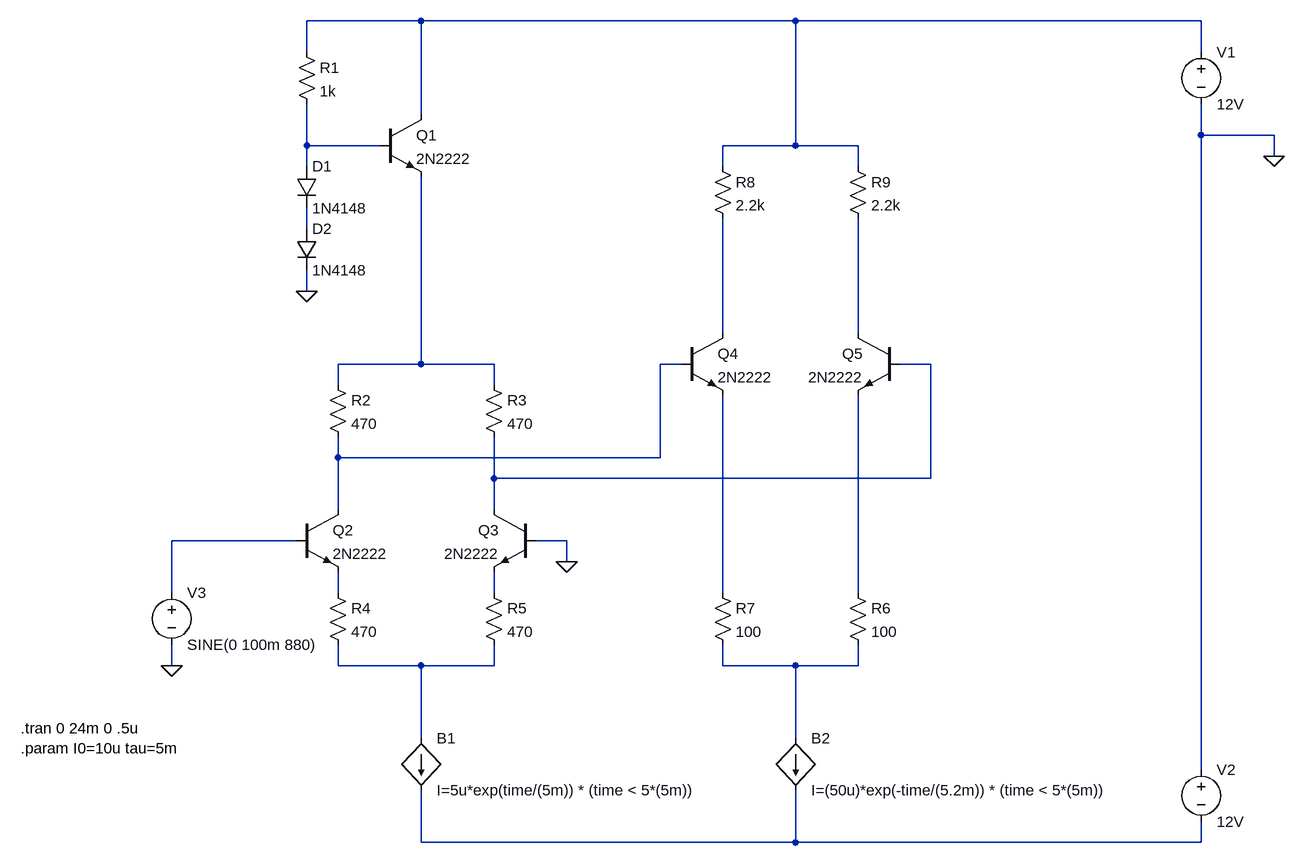
[diagram p0: schematic rabotnik_v1.asc]
rabotnik_v1.asc, the LTspice schematic file:
Version 4
SHEET 1 1540 1352
WIRE 208 80 32 80
WIRE 784 80 208 80
WIRE 1408 80 784 80
WIRE 32 128 32 80
WIRE 1408 128 1408 80
WIRE 208 224 208 80
WIRE 1408 256 1408 208
WIRE 1520 256 1408 256
WIRE 32 272 32 208
WIRE 144 272 32 272
WIRE 784 272 784 80
WIRE 784 272 672 272
WIRE 880 272 784 272
WIRE 1520 288 1520 256
WIRE 32 304 32 272
WIRE 672 304 672 272
WIRE 880 304 880 272
WIRE 32 400 32 368
WIRE 32 496 32 464
WIRE 672 560 672 384
WIRE 880 560 880 384
WIRE 208 608 208 320
WIRE 208 608 80 608
WIRE 320 608 208 608
WIRE 608 608 576 608
WIRE 992 608 944 608
WIRE 80 640 80 608
WIRE 320 640 320 608
WIRE 80 752 80 720
WIRE 576 752 576 608
WIRE 576 752 80 752
WIRE 320 784 320 720
WIRE 992 784 992 608
WIRE 992 784 320 784
WIRE 80 832 80 752
WIRE 320 832 320 784
WIRE 16 880 -176 880
WIRE 432 880 384 880
WIRE 432 912 432 880
WIRE -176 960 -176 880
WIRE 80 960 80 928
WIRE 320 960 320 928
WIRE 672 960 672 656
WIRE 880 960 880 656
WIRE -176 1072 -176 1040
WIRE 80 1072 80 1040
WIRE 208 1072 80 1072
WIRE 320 1072 320 1040
WIRE 320 1072 208 1072
WIRE 672 1072 672 1040
WIRE 784 1072 672 1072
WIRE 880 1072 880 1040
WIRE 880 1072 784 1072
WIRE 208 1184 208 1072
WIRE 784 1184 784 1072
WIRE 1408 1232 1408 256
WIRE 208 1344 208 1264
WIRE 784 1344 784 1264
WIRE 784 1344 208 1344
WIRE 1408 1344 1408 1312
WIRE 1408 1344 784 1344
FLAG 32 496 0
FLAG 1520 288 0
FLAG 432 912 0
FLAG -176 1072 0
SYMBOL npn2 144 224 R0
SYMATTR InstName Q1
SYMATTR Value 2N2222
SYMBOL voltage 1408 112 R0
WINDOW 123 0 0 Left 0
WINDOW 39 0 0 Left 0
SYMATTR InstName V1
SYMATTR Value 12V
SYMBOL voltage 1408 1216 R0
WINDOW 123 0 0 Left 0
WINDOW 39 0 0 Left 0
SYMATTR InstName V2
SYMATTR Value 12V
SYMBOL res 16 112 R0
SYMATTR InstName R1
SYMATTR Value 1k
SYMBOL diode 16 304 R0
SYMATTR InstName D1
SYMATTR Value 1N4148
SYMBOL diode 16 400 R0
SYMATTR InstName D2
SYMATTR Value 1N4148
SYMBOL res 304 624 R0
SYMATTR InstName R3
SYMATTR Value 470
SYMBOL res 64 624 R0
SYMATTR InstName R2
SYMATTR Value 470
SYMBOL npn2 16 832 R0
SYMATTR InstName Q2
SYMATTR Value 2N2222
SYMBOL npn2 384 832 M0
SYMATTR InstName Q3
SYMATTR Value 2N2222
SYMBOL res 64 944 R0
SYMATTR InstName R4
SYMATTR Value 470
SYMBOL res 304 944 R0
SYMATTR InstName R5
SYMATTR Value 470
SYMBOL voltage -176 944 R0
WINDOW 123 0 0 Left 0
WINDOW 39 0 0 Left 0
SYMATTR InstName V3
SYMATTR Value SINE(0 100m 880)
SYMBOL npn2 608 560 R0
SYMATTR InstName Q4
SYMATTR Value 2N2222
SYMBOL npn2 944 560 M0
SYMATTR InstName Q5
SYMATTR Value 2N2222
SYMBOL res 864 944 R0
SYMATTR InstName R6
SYMATTR Value 100
SYMBOL res 656 944 R0
SYMATTR InstName R7
SYMATTR Value 100
SYMBOL res 656 288 R0
SYMATTR InstName R8
SYMATTR Value 2.2k
SYMBOL res 864 288 R0
SYMATTR InstName R9
SYMATTR Value 2.2k
SYMBOL bi 208 1184 R0
SYMATTR InstName B1
SYMATTR Value I=5u*exp(time/(5m)) * (time < 5*(5m))
SYMBOL bi 784 1184 R0
SYMATTR InstName B2
SYMATTR Value I=(50u)*exp(-time/(5.2m)) * (time < 5*(5m))
TEXT -408 1168 Left 2 !.tran 0 24m 0 .5u\n.param I0=10u tau=5m

The netlist it stands for:
* rabotnik_v1.asc
Q1 N001 N002 N006 0 2N2222
V1 N001 0 12V
V2 0 N016 12V
R1 N001 N002 1k
D1 N002 N003 1N4148
D2 N003 0 1N4148
R3 N006 N008 470
R2 N006 N007 470
Q2 N007 N009 N010 0 2N2222
Q3 N008 0 N011 0 2N2222
R4 N010 N014 470
R5 N011 N014 470
V3 N009 0 SINE(0 100m 880)
Q4 N004 N007 N012 0 2N2222
Q5 N005 N008 N013 0 2N2222
R6 N013 N015 100
R7 N012 N015 100
R8 N001 N004 2.2k
R9 N001 N005 2.2k
B1 N014 N016 I=5u*exp(time/(5m)) * (time < 5*(5m))
B2 N015 N016 I=(50u)*exp(-time/(5.2m)) * (time < 5*(5m))
.model D D
.lib standard.dio
.model NPN NPN
.model PNP PNP
.lib standard.bjt
.tran 0 24m 0 .5u
.param I0=10u tau=5m
.backanno
.end